# Altium project USB.PrjPcb
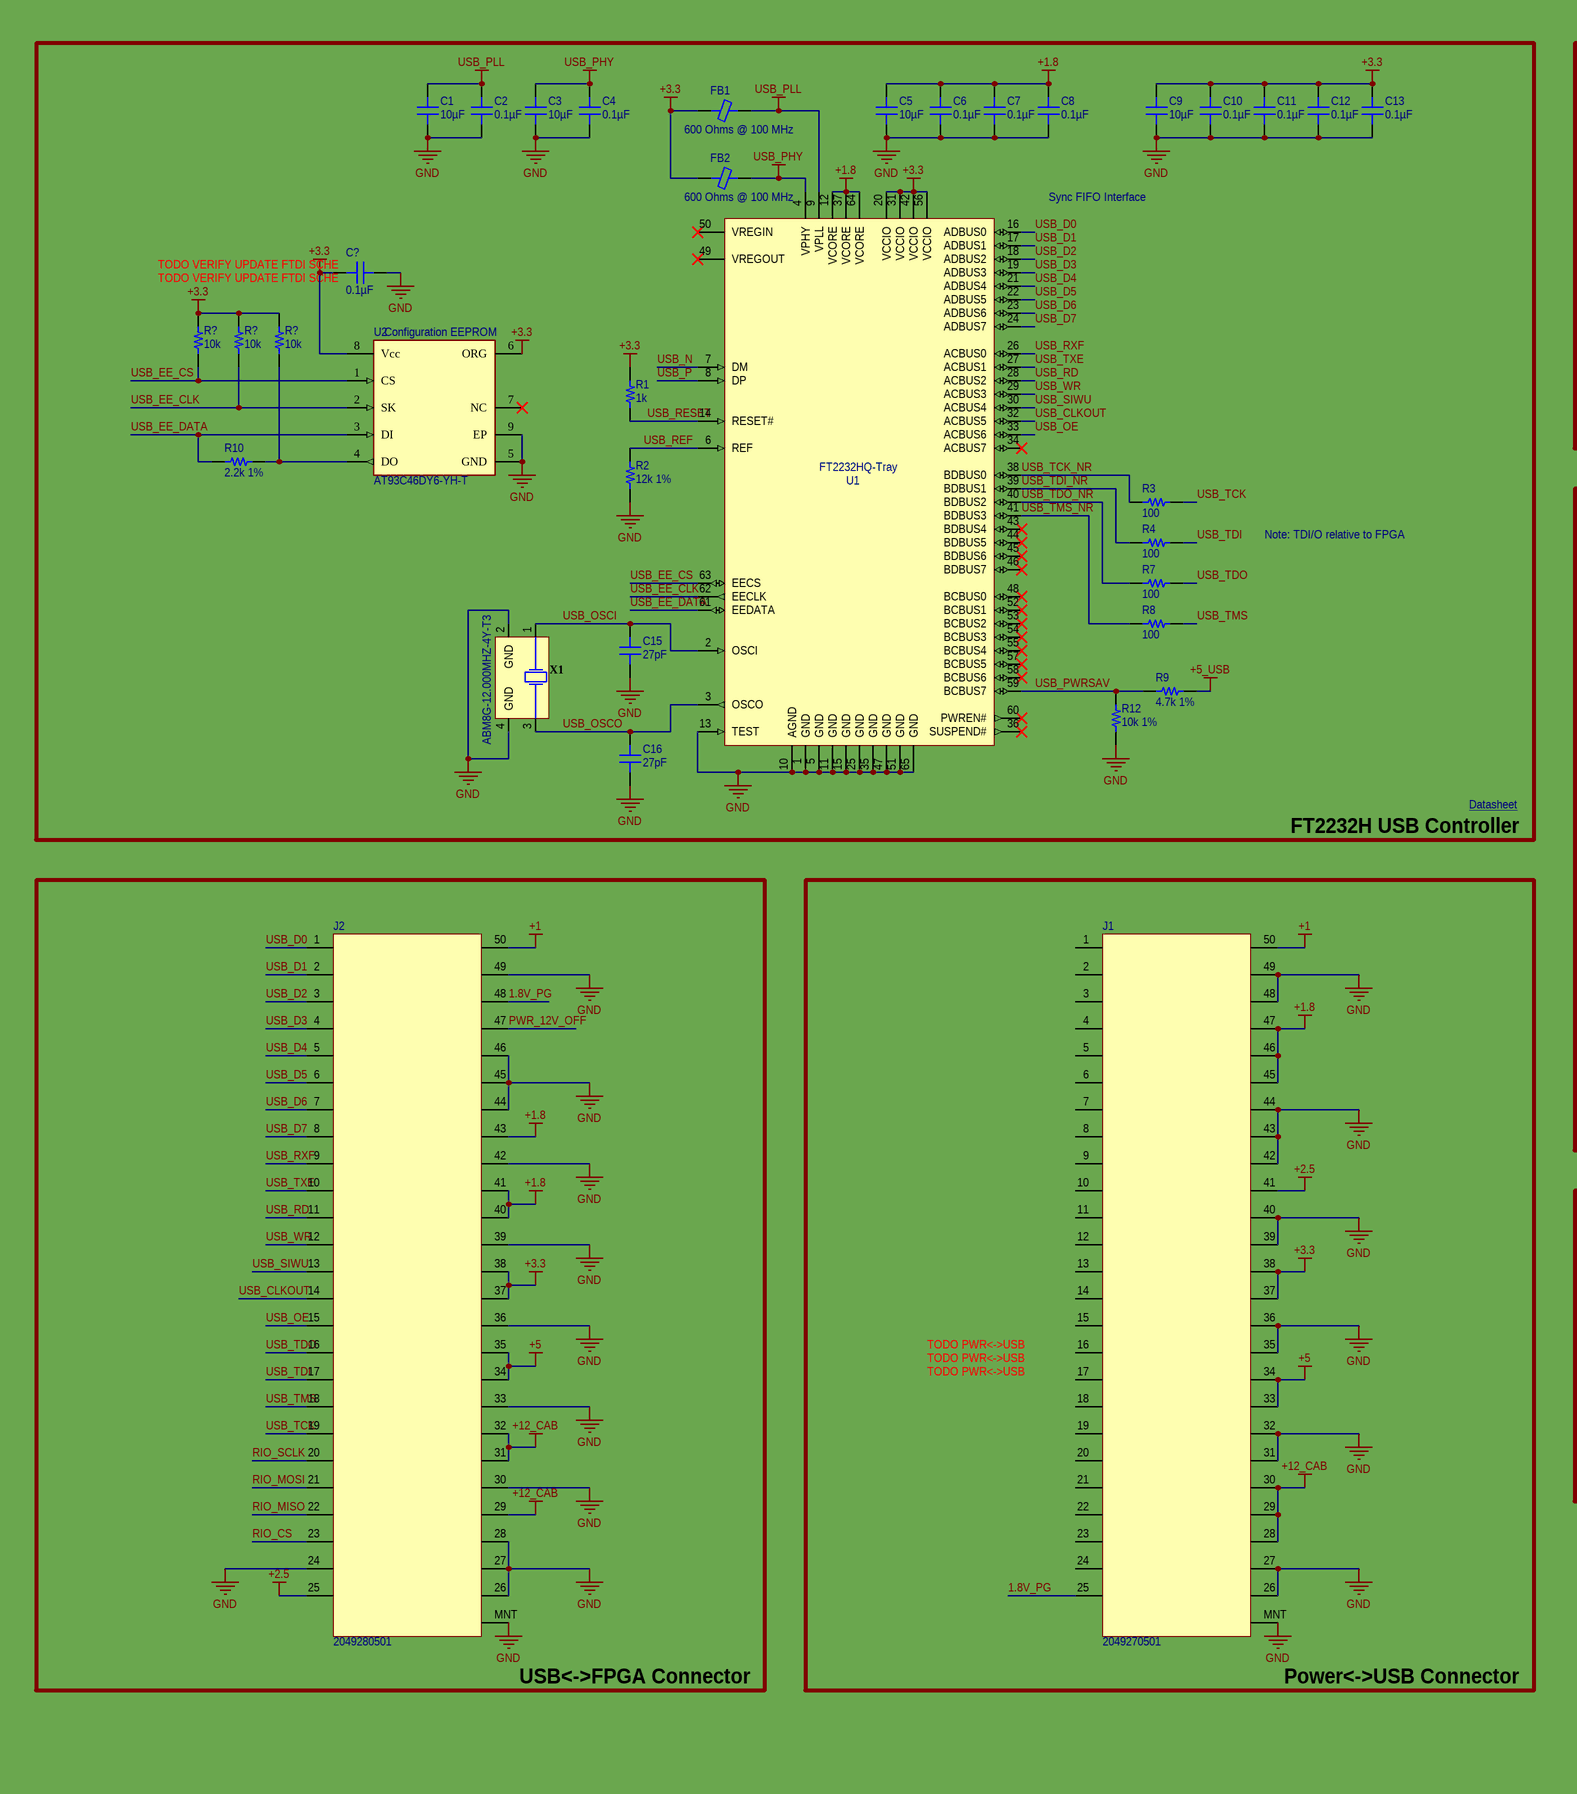
[diagram p0: USB.SchDoc, left]
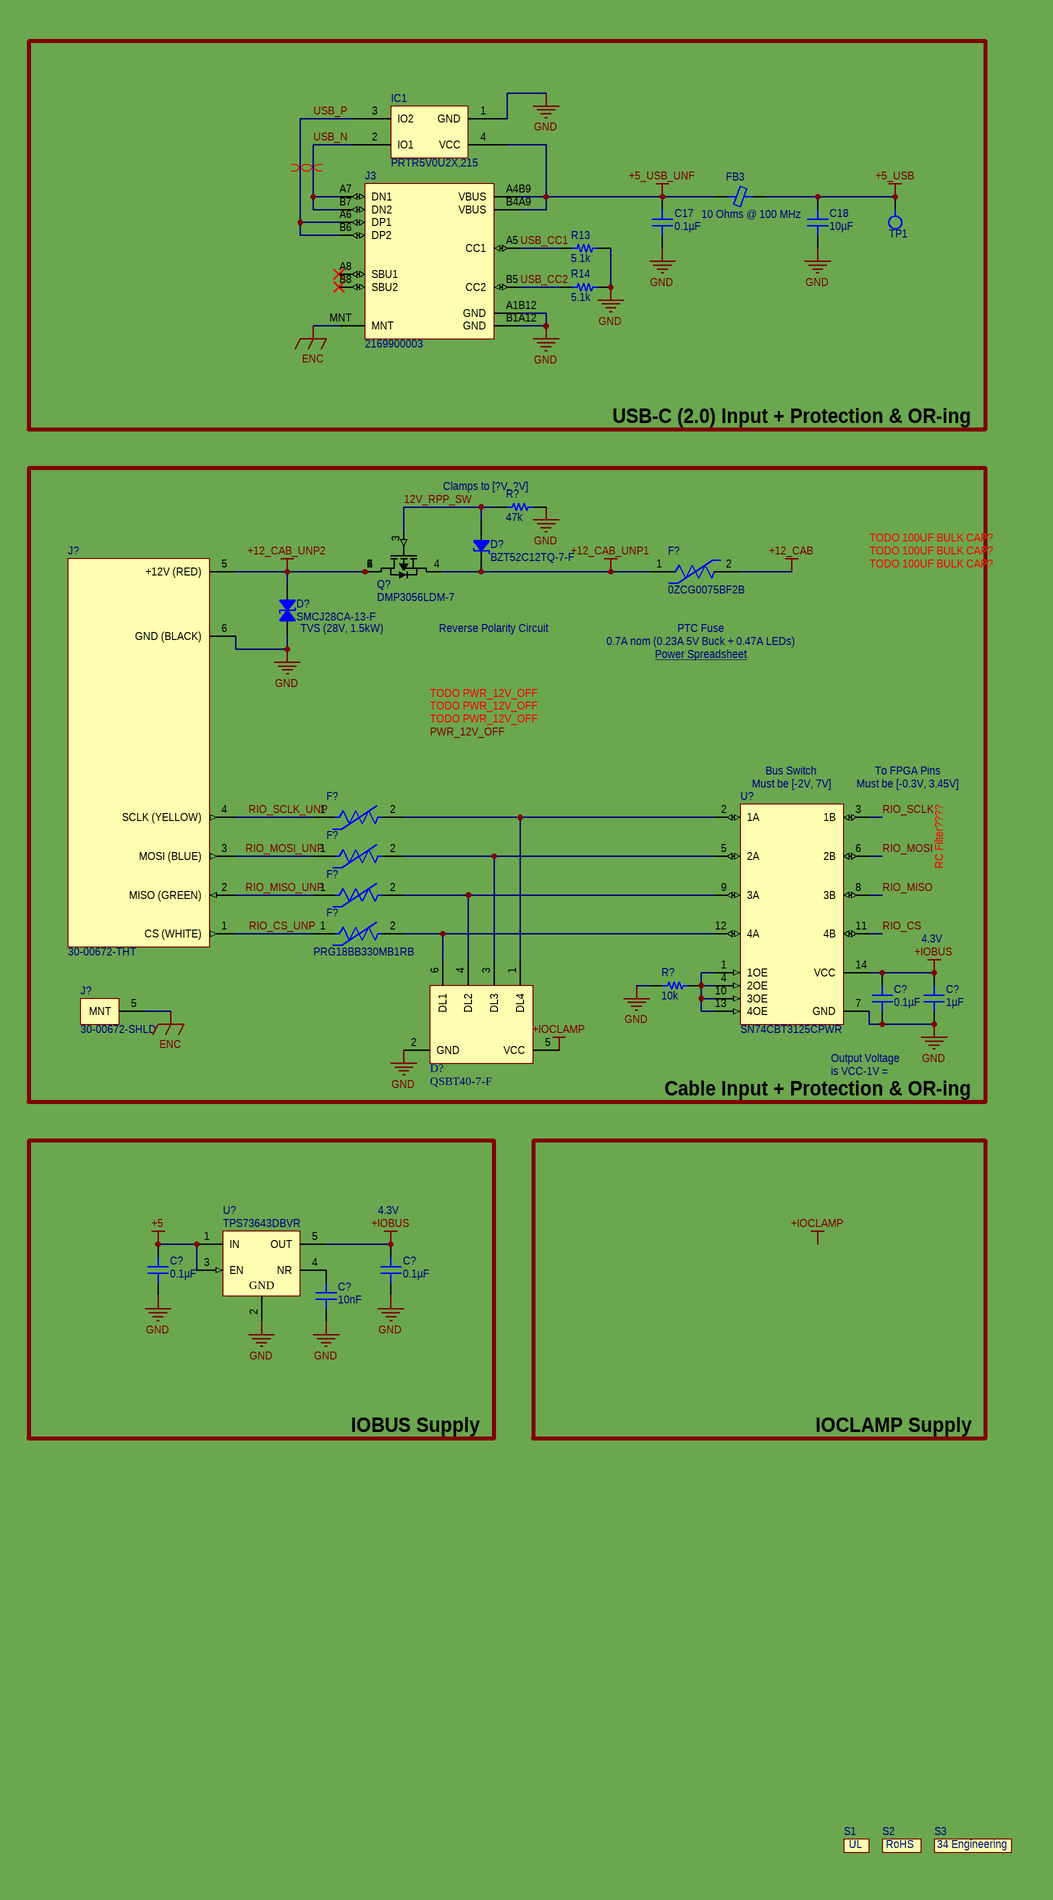
[diagram p1: USB.SchDoc, right]
1 sheet, 66 parts. Net scope: global (net labels, ports and power ports of the same name join across sheets).
Board file: USB.PcbDoc

## Sheet USB.SchDoc
size C; SheetNumber: 1; SheetTotal: 1

### Parts
(Parts that share a designator on the sheet are numbered #1, #2 ... from top to bottom, then left to right.)
C1  10µF  [CAP 0402_1005]
C2  0.1µF  [CAP 0402_1005]
C3  10µF  [CAP 0402_1005]
C4  0.1µF  [CAP 0402_1005]
C5  10µF  [CAP 0402_1005]
C6  0.1µF  [CAP 0402_1005]
C7  0.1µF  [CAP 0402_1005]
C8  0.1µF  [CAP 0402_1005]
C9  10µF  [CAP 0402_1005]
C10  0.1µF  [CAP 0402_1005]
C11  0.1µF  [CAP 0402_1005]
C12  0.1µF  [CAP 0402_1005]
C13  0.1µF  [CAP 0402_1005]
C15  27pF  [CAP 0402_1005]
C16  27pF  [CAP 0402_1005]
C17  0.1µF  [CAP 0402_1005]
C18  10µF  [CAP 0402_1005]
C?#1  0.1µF  [CAP 0402_1005]
C?#2  0.1µF  [CAP 0402_1005]
C?#3  1µF  [CAP 0402_1005]
C?#4  0.1µF  [CAP 0402_1005]
C?#5  0.1µF  [CAP 0402_1005]
C?#6  10nF  [CAP 0402_1005]
D?#1  BZT52C12TQ-7-F  [SOD523F]
D?#2  SMCJ28CA-13-F  [DO214AB SMC]
D?#3  QSBT40-7-F  [QSBT40-7-F]
F?#1  0ZCG0075BF2B  [FP-0ZCG0075BF2B-MFG]
F?#2  PRG18BB330MB1RB  [FP-PRF18-PRG18-0_15-MFG]
F?#3  PRG18BB330MB1RB  [FP-PRF18-PRG18-0_15-MFG]  (value not drawn)
F?#4  PRG18BB330MB1RB  [FP-PRF18-PRG18-0_15-MFG]  (value not drawn)
F?#5  PRG18BB330MB1RB  [FP-PRF18-PRG18-0_15-MFG]  (value not drawn)
FB1  600 Ohms @ 100 MHz  [FER 0603_1608]
FB2  600 Ohms @ 100 MHz  [FER 0603_1608]
FB3  10 Ohms @ 100 MHz  [FER 0402_1005]
IC1  PRTR5V0U2X,215  [SOT143B]
J1  2049270501  [2049270501]
J2  2049280501  [2049280501]
J3  2169900003  [2169900003]
J?#1  30-00672-THT  [30-00672-THT]
J?#2  30-00672-SHLD  [30-00672-SHLD]
Q?  DMP3056LDM-7  [SOT95P285X130-6N]
R1  1k  [RES 0402_1005]
R2  12k 1%  [RES 0402_1005]
R3  100  [RES 0402_1005]
R4  100  [RES 0402_1005]
R7  100  [RES 0402_1005]
R8  100  [RES 0402_1005]
R9  4.7k 1%  [RES 0402_1005]
R10  2.2k 1%  [RES 0402_1005]
R12  10k 1%  [RES 0402_1005]
R13  5.1k  [RES 0402_1005]
R14  5.1k  [RES 0402_1005]
R?#1  10k  [RES 0402_1005]
R?#2  10k  [RES 0402_1005]
R?#3  10k  [RES 0402_1005]
R?#4  47k  [RES 0603_1608]
R?#5  10k  [RES 0402_1005]
S1  (no value)  [UL]
S2  (no value)  [RoHS]
S3  (no value)  [34EngineeringLogo]
TP1  (no value)  [TestPoint1mm]
U1  FT2232HQ-Tray  [QFN64_2_N]
U2  AT93C46DY6-YH-T  [FP-C04-21355-Q4B-IPC_C]
U?#1  SN74CBT3125CPWR  [SN74CBT3125CPWR]
U?#2  TPS73643DBVR  [DBV0005A_N]
X1  ABM8G-12.000MHZ-4Y-T3  [ABM8G-12.000MHZ-4Y-T3]

### Blocks framed on the sheet
FT2232H USB Controller: C1-C13 C15 C16 C?#1 FB1 FB2 R1-R4 R7-R10 R12 R?#1-R?#3 U1 U2 X1
USB-C (2.0) Input + Protection & OR-ing: C17 C18 FB3 IC1 J3 R13 R14 TP1
Cable Input + Protection & OR-ing: C?#2 C?#3 D?#1-D?#3 F?#1-F?#5 J?#1 J?#2 Q? R?#4 R?#5 U?#1
USB<->FPGA Connector: J2
Power<->USB Connector: J1
IOBUS Supply: C?#4-C?#6 U?#2

### Nets
+1: J1.50 J2.50
+1.8: C5.2 C6.2 C7.2 C8.2 J1.45 J1.46 J1.47 J2.40 J2.41 J2.43 U1.12(VCORE) U1.37(VCORE) U1.64(VCORE)
+2.5: J1.41 J2.25
+3.3: C9.2 C10.2 C11.2 C12.2 C13.2 C?#1.2 FB1.1 FB2.1 J1.37 J1.38 J2.37 J2.38 R1.1 R?#1.2 R?#2.2 R?#3.2 U1.20(VCCIO) U1.31(VCCIO) U1.42(VCCIO) U1.56(VCCIO) U2.6(ORG) U2.8(Vcc)
+5: C?#4.1 J1.33 J1.34 J2.34 J2.35 U?#2.1(IN) U?#2.3(EN)
+5_USB: C18.2 FB3.2 R9.2 TP1.1
+5_USB_UNF: C17.2 FB3.1 IC1.4(VCC) J3.A4B9(VBUS) J3.B4A9(VBUS)
+12_CAB: F?#1.2 J1.28 J1.29 J1.30 J2.29 J2.31 J2.32
+12_CAB_UNP1: D?#1.2 F?#1.1 Q?.4
+12_CAB_UNP2: D?#2.2 J?#1.5(+12V_(RED)) Q?.1 Q?.2 Q?.5 Q?.6
+IOBUS: C?#2.1 C?#3.2 C?#5.1 U?#1.14(VCC) U?#2.5(OUT)
+IOCLAMP: D?#3.5(VCC)
ENC: J3.MNT J?#2.5(MNT)
GND: C1.1 C2.1 C3.1 C4.1 C5.1 C6.1 C7.1 C8.1 C9.1 C10.1 C11.1 C12.1 C13.1 C15.1 C16.1 C17.1 C18.1 C?#1.1 C?#2.2 C?#3.1 C?#4.2 C?#5.2 C?#6.1 D?#2.1 D?#3.2(GND) IC1.1(GND) J1.26 J1.27 J1.31 J1.32 J1.35 J1.36 J1.39 J1.40 J1.42 J1.43 J1.44 J1.48 J1.49 J1.MNT J2.24 J2.26 J2.27 J2.28 J2.30 J2.33 J2.36 J2.39 J2.42 J2.44 J2.45 J2.46 J2.49 J2.MNT J3.A1B12(GND) J3.B1A12(GND) J?#1.6(GND_(BLACK)) R2.1 R12.1 R13.2 R14.2 R?#4.2 R?#5.2 U1.1(GND) U1.5(GND) U1.10(AGND) U1.11(GND) U1.13(TEST) U1.15(GND) U1.25(GND) U1.35(GND) U1.47(GND) U1.51(GND) U1.65(GND) U2.5(GND) U2.9(EP) U?#1.7(GND) U?#2.2(GND) X1.2(GND) X1.4(GND)
USB_PHY: C3.2 C4.2 FB2.2 U1.4(VPHY)
USB_PLL: C1.2 C2.2 FB1.2 U1.9(VPLL)
1.8V_PG: J1.25 J2.48
12V_RPP_SW: D?#1.1 Q?.3 R?#4.1
PWR_12V_OFF: J2.47
RIO_CS: J2.23 U?#1.11(4B)
RIO_CS_UNP: F?#5.1 J?#1.1(CS_(WHITE))
RIO_MISO: J2.22 U?#1.8(3B)
RIO_MISO_UNP: F?#4.1 J?#1.2(MISO_(GREEN))
RIO_MOSI: J2.21 U?#1.6(2B)
RIO_MOSI_UNP: F?#3.1 J?#1.3(MOSI_(BLUE))
RIO_SCLK: J2.20 U?#1.3(1B)
RIO_SCLK_UNP: F?#2.1 J?#1.4(SCLK_(YELLOW))
USB_CC1: J3.A5(CC1) R13.1
USB_CC2: J3.B5(CC2) R14.1
USB_CLKOUT: J2.14 U1.32(ACBUS5)
USB_D0: J2.1 U1.16(ADBUS0)
USB_D1: J2.2 U1.17(ADBUS1)
USB_D2: J2.3 U1.18(ADBUS2)
USB_D3: J2.4 U1.19(ADBUS3)
USB_D4: J2.5 U1.21(ADBUS4)
USB_D5: J2.6 U1.22(ADBUS5)
USB_D6: J2.7 U1.23(ADBUS6)
USB_D7: J2.8 U1.24(ADBUS7)
USB_EE_CLK: R?#2.1 U1.62(EECLK) U2.2(SK)
USB_EE_CS: R?#1.1 U1.63(EECS) U2.1(CS)
USB_EE_DATA: R10.2 U1.61(EEDATA) U2.3(DI)
USB_N: IC1.2(IO1) J3.A7(DN1) J3.B7(DN2) U1.7(DM)
USB_OE: J2.15 U1.33(ACBUS6)
USB_OSCI: C15.2 U1.2(OSCI) X1.1
USB_OSCO: C16.2 U1.3(OSCO) X1.3
USB_P: IC1.3(IO2) J3.A6(DP1) J3.B6(DP2) U1.8(DP)
USB_PWRSAV: R9.1 R12.2 U1.59(BCBUS7)
USB_RD: J2.11 U1.28(ACBUS2)
USB_REF: R2.2 U1.6(REF)
USB_RESET: R1.2 U1.14(RESET#)
USB_RXF: J2.9 U1.26(ACBUS0)
USB_SIWU: J2.13 U1.30(ACBUS4)
USB_TCK: J2.19 R3.2
USB_TCK_NR: R3.1 U1.38(BDBUS0)
USB_TDI: J2.17 R4.2
USB_TDI_NR: R4.1 U1.39(BDBUS1)
USB_TDO: J2.16 R7.2
USB_TDO_NR: R7.1 U1.40(BDBUS2)
USB_TMS: J2.18 R8.2
USB_TMS_NR: R8.1 U1.41(BDBUS3)
USB_TXE: J2.10 U1.27(ACBUS1)
USB_WR: J2.12 U1.29(ACBUS3)
NetC?#6_2: C?#6.2 U?#2.4(NR)
NetD?#3_1: D?#3.1(DL4) F?#2.2 U?#1.2(1A)
NetD?#3_3: D?#3.3(DL3) F?#3.2 U?#1.5(2A)
NetD?#3_4: D?#3.4(DL2) F?#4.2 U?#1.9(3A)
NetD?#3_6: D?#3.6(DL1) F?#5.2 U?#1.12(4A)
NetR10_1: R10.1 R?#3.1 U2.4(DO)
NetR?#5_1: R?#5.1 U?#1.1(1OE) U?#1.4(2OE) U?#1.10(3OE) U?#1.13(4OE)

Not connected (* = marked no-connect by the designer): J1 1 2 3 4 5 6 7 8 9 10 11 12 13 14 15 16 17 18 19 20 21 22 23 24; J3 A8(SBU1)* B8(SBU2)*; U1 34(ACBUS7)* 36(SUSPEND#)* 43(BDBUS4)* 44(BDBUS5)* 45(BDBUS6)* 46(BDBUS7)* 48(BCBUS0)* 49(VREGOUT)* 50(VREGIN)* 52(BCBUS1)* 53(BCBUS2)* 54(BCBUS3)* 55(BCBUS4)* 57(BCBUS5)* 58(BCBUS6)* 60(PWREN#)*; U2 7(NC)*

### Layout directives
differential pair; differential pair class USB: USB_N, USB_P

### Notes on the sheet
- Sync FIFO Interface
- (near C?#1) TODO VERIFY UPDATE FTDI SCHE
- (near U2) Configuration EEPROM
- (near R?#4) Clamps to [?V, ?V]
- Note: TDI/O relative to FPGA
- TODO 100UF BULK CAP?
- (near D?#2) TVS (28V, 1.5kW)
- Reverse Polarity Circuit
- PTC Fuse
- TODO PWR_12V_OFF
- Power Spreadsheet <https://docs.google.com/spreadsheets/d/1ZgsUlgWdU-n38x_ZLdApPnWk-g0t3dJyEVXrgmfgov0/edit#gid=0>
- 0.7A nom (0.23A 5V Buck + 0.47A LEDs)
- Datasheet <https://www.ftdichip.com/Support/Documents/DataSheets/ICs/DS_FT2232H.pdf>
- (near U?#1) Must be [-2V, 7V]
- (near U?#1) Bus Switch
- (near U?#1) Must be [-0.3V, 3.45V]
- (near U?#1) To FPGA Pins
- RC Filter????
- (near C?#3) 4.3V
- Output Voltage is VCC-1V = 3.3V
- (near C?#5) 4.3V
- TODO PWR<->USB
- IOCLAMP Supply
- Labels drawn without touching a wire or pin: +IOCLAMP, PWR_12V_OFF
- (in symbol 34EngineeringLogo) 34 Engineering

### Library data of the parts
C1 C3 C5 C9 C18 = 0402ZD106MAT2A: CAP CER 10UF 10V X5R 0402; manufacturer: AVX Corporation; Tolerance: ±20%; Part Number: 0402ZD106MAT2A; Value: 10µF; Applications: General Purpose; Capacitance: 10µF; componentlink1description: Datasheet; componentlink1url: http://datasheets.avx.com/cx5r.pdf; componentlink2description: DigiKey Link; componentlink2url: http://digikey.com/product-detail/en/avx-corporation/0402ZD106MAT2A/478-10052-1-ND/6564275; Device Package: 0402 (1005 Metric); lastupdated: 2/8/2022 12:26:50 PM; Lifecycle Status: Active; Minimum Order: 1; Mounting Type: Surface Mount, MLCC; Operating Temperature: -55°C ~ 85°C; Package / Case: 0402 (1005 Metric); packaging: TapeAndReel; partid: 6854; Part Status: Active; price: 0.24; series: -; Size / Dimension: 0.039" L x 0.020" W (1.00mm x 0.50mm); Supplier 1: DigiKey; Supplier Part Number 1: 478-10052-1-ND; Temperature Coefficient: X5R; Thickness (Max): 0.028" (0.71mm); Voltage - Rated: 10V
C2 C4 C6-C8 C10-C13 C17 C?#1 C?#2 C?#4 C?#5 = 0402ZC104KAT2A: CAP CER 0.1UF 10V X7R 0402; manufacturer: AVX Corporation; Tolerance: ±10%; Part Number: 0402ZC104KAT2A; Value: 0.1µF; Applications: General Purpose; Capacitance: 0.1µF; componentlink1description: Datasheet; componentlink1url: http://datasheets.avx.com/X7RDielectric.pdf; componentlink2description: DigiKey Link; componentlink2url: http://digikey.com/product-detail/en/avx-corporation/0402ZC104KAT2A/478-7891-1-ND/3881514; Device Package: 0402 (1005 Metric); lastupdated: 2/8/2022 12:26:59 PM; Lifecycle Status: Active; Minimum Order: 1; Mounting Type: Surface Mount, MLCC; Operating Temperature: -55°C ~ 125°C; Package / Case: 0402 (1005 Metric); packaging: TapeAndReel; partid: 1757; Part Status: Active; price: 0.09; series: -; Size / Dimension: 0.039" L x 0.020" W (1.00mm x 0.50mm); Supplier 1: DigiKey; Supplier Part Number 1: 478-7891-1-ND; Temperature Coefficient: X7R; Thickness (Max): 0.022" (0.55mm); Voltage - Rated: 10V
C15 C16 = C0402C270J3GAC7867: CAP CER 27PF 25V NP0 0402; manufacturer: KEMET; Temperature Coefficient: C0G, NP0; Tolerance: ±5%; Part Number: C0402C270J3GAC7867; Value: 27 pF; Applications: General Purpose; Capacitance: 27 pF; componentlink1description: Datasheet; componentlink1url: https://api.kemet.com/component-edge/download/datasheet/C0402C270J3GACTU.pdf; componentlink2description: DigiKey Link; componentlink2url: https://www.digikey.com/en/products/detail/kemet/C0402C270J3GAC7867/2196521; Device Package: 0402 (1005 Metric); Features: Low ESL; lastupdated: 7/10/2022 8:59:41 AM; Lifecycle Status: Active; Minimum Order: 1; Mounting Type: Surface Mount, MLCC; Operating Temperature: -55°C ~ 125°C; Package / Case: 0402 (1005 Metric); packaging: TapeAndReel; partid: 1740; Part Status: Active; price: 0.06; series: SMD Comm C0G; Size / Dimension: 0.039" L x 0.020" W (1.00mm x 0.50mm); Supplier 1: DigiKey; Supplier Part Number 1: 399-14437-1-ND; Thickness (Max): 0.022" (0.55mm); Voltage - Rated: 25V
C?#3 = GRM155C71A105KE11D: CAP CER 1UF 10V X7S 0402; manufacturer: Murata Electronics; Tolerance: ±10%; Part Number: GRM155C71A105KE11D; Value: 1µF; Applications: General Purpose; Capacitance: 1 µF; componentlink1description: Datasheet; componentlink1url: https://search.murata.co.jp/Ceramy/image/img/A01X/G101/ENG/GRM155C71A105KE11-01.pdf; componentlink2description: DigiKey Link; componentlink2url: https://www.digikey.com/en/products/detail/murata-electronics/GRM155C71A105KE11D/6606086; Device Package: 0402 (1005 Metric); lastupdated: 8/25/2022 6:45:54 AM; Lifecycle Status: Active; Minimum Order: 1; Mounting Type: Surface Mount, MLCC; Operating Temperature: -55°C ~ 125°C; Package / Case: 0402 (1005 Metric); packaging: TapeAndReel; partid: 1749; Part Status: Active; price: 0.01; series: GRM; Size / Dimension: 0.039" L x 0.020" W (1.00mm x 0.50mm); Supplier 1: DigiKey; Supplier Part Number 1: 490-14457-1-ND; Temperature Coefficient: X7S; Thickness (Max): 0.024" (0.60mm); Voltage - Rated: 10V
C?#6 = CL05B103KA5VPNC: CAP CER 10000PF 25V X7R 0402; manufacturer: Samsung Electro-Mechanics; Tolerance: ±10%; Part Number: CL05B103KA5VPNC; Value: 10nF; Applications: Automotive; Capacitance: 10000 pF; componentlink1description: Datasheet; componentlink1url: http://www.samsungsem.com/kr/support/product-search/mlcc/CL05B103KA5VPNC.jsp; componentlink2description: DigiKey Link; componentlink2url: https://www.digikey.com/en/products/detail/samsung-electro-mechanics/CL05B103KA5VPNC/5961208; Device Package: 0402 (1005 Metric); lastupdated: 8/25/2022 6:45:53 AM; Lifecycle Status: Active; Minimum Order: 1; Mounting Type: Surface Mount, MLCC; Operating Temperature: -55°C ~ 125°C; Package / Case: 0402 (1005 Metric); packaging: TapeAndReel; partid: 1881; Part Status: Active; price: 0.01; Ratings: AEC-Q200; series: CL; Size / Dimension: 0.039" L x 0.020" W (1.00mm x 0.50mm); Supplier 1: DigiKey; Supplier Part Number 1: 1276-6724-1-ND; Temperature Coefficient: X7R; Thickness (Max): 0.022" (0.55mm); Voltage - Rated: 25V
D?#1 = BZT52C12TQ-7-F: DIODE ZENER 12V 300MW SOD523; Manufacturer: Diodes Incorporated; Current - Reverse Leakage @ Vr: 100 nA @ 8 V; Impedance (Max) (Zzt): 25 Ohms; Tolerance: ±5.4%; Voltage - Forward (Vf) (Max) @ If: 900 mV @ 10 mA; Part Number: BZT52C12TQ-7-F; ComponentLink1Description: Datasheet; ComponentLink1URL: https://www.diodes.com/assets/Datasheets/ds30502.pdf; ComponentLink2Description: DigiKey Link; ComponentLink2URL: https://www.digikey.com/en/products/detail/diodes-incorporated/BZT52C12TQ-7-F/8126111; LastUpdated: 8/14/2022 9:55:24 PM; Lifecycle Status: Active; Minimum Order: 1; Mounting Type: Surface Mount; Operating Temperature: -65°C ~ 150°C (TJ); Package / Case: SC-79, SOD-523; Packaging: TapeAndReel; PartId: 3438; Part Status: Active; Power - Max: 300 mW; Price: 0.03; Series: Automotive, AEC-Q101; Supplier 1: DigiKey; Supplier Part Number 1: BZT52C12TQ-7-FDICT-ND; Supplier Device Package: SOD-523; Voltage - Zener (Nom) (Vz): 12 V
D?#2 = SMCJ28CA-13-F: TVS DIODE 28VWM 45.4VC SMC; Manufacturer: Diodes Incorporated; Bidirectional Channels: 1; Current - Peak Pulse (10/1000µs): 33A; Power Line Protection: No; Power - Peak Pulse: 1500W (1.5kW); Type: Zener; Voltage - Breakdown (Min): 31.1V; Voltage - Clamping (Max) @ Ipp: 45.4V; Voltage - Reverse Standoff (Typ): 28V; Part Number: SMCJ28CA-13-F; Applications: General Purpose; ComponentLink1Description: Datasheet; ComponentLink1URL: https://www.diodes.com/assets/Datasheets/ds19003.pdf; ComponentLink2Description: DigiKey Link; ComponentLink2URL: https://www.digikey.com/en/products/detail/diodes-incorporated/SMCJ28CA-13-F/765437; LastUpdated: 8/14/2022 10:10:35 PM; Lifecycle Status: Active; Minimum Order: 1; Mounting Type: Surface Mount; Operating Temperature: -55°C ~ 150°C (TJ); Package / Case: DO-214AB, SMC; Packaging: TapeAndReel; PartId: 8285; Part Status: Active; Price: 0.35; Series: -; Supplier 1: DigiKey; Supplier Part Number 1: SMCJ28CA-FDICT-ND; Supplier Device Package: SMC
D?#3 = QSBT40-7-F: TVS DIODE 30VWM SOT363; Manufacturer: Diodes; Forward Current: 200mA; Max Reverse Current: 2uA; Forward Voltage: 1V; Max Power Dissipation: 2W; Operating Supply Voltage: 30V; Number of Bidirectional Channels: 4; Power Line Protection: No; Reverse Recovery Time: 5ns; Peak Non-Repetitive Surge Current: 600mA; Power Dissipation: 200mW; Supplier 1: RSComponents; Manufacturer Part Number: QSBT40-7-F; RoHS: Yes; Category: Schottky Diodes; Stock 1: 1; Pricing 1: 10=1.12300, 30=0.92500, 150=0.80600, 750=0.71200, 1500=0.56500 (USD); Mount: Surface Mount; Case/Package: SOT-363; Number of Pins: 6; Weight: 0.000212oz; Min Operating Temperature: -55°C; Max Operating Temperature: 125°C; Package Quantity: 3000; Packaging: Tape and Reel; Reverse Standoff Voltage: 30V; Max Repetitive Reverse Voltage (Vrrm): 30V; Max Forward Surge Current (Ifsm): 600mA; Termination: SMD/SMT; Power Rating: 200mW; Voltage Rating (DC): 30V; Current Rating: 200mA; Series: -; Length: 2.2mm; Width: 1.35mm; Height: 1mm; Radiation Hardening: No; REACH SVHC: No SVHC; Lead Free: Lead Free; RoHS Compliant: Yes; ComponentLink1URL: https://datasheet.ciiva.com/34302/1541351-34302412.pdf?src-supplier=Jameco; ComponentLink1Description: https://datasheet.ciiva.com/34302/1541351-34302412.pdf?src-supplier=Jameco; ComponentLink2URL: https://datasheet.ciiva.com/4715/ds30195-18356-4715689.pdf?src-supplier=Mouser; ComponentLink2Description: https://datasheet.ciiva.com/4715/ds30195-18356-4715689.pdf?src-supplier=Mouser; ComponentLink3URL: https://datasheet.ciiva.com/336/ds30195-336560.pdf?src-supplier=Digi-Key; ComponentLink3Description: https://datasheet.ciiva.com/336/ds30195-336560.pdf?src-supplier=Digi-Key; ComponentLink4URL: https://datasheet.ciiva.com/8301/ds30195-8301644.pdf?src-supplier=Avnet; ComponentLink4Description: https://datasheet.ciiva.com/8301/ds30195-8301644.pdf?src-supplier=Avnet; ComponentLink5URL: https://datasheet.ciiva.com/16393/ds30195-16393583.pdf?src-supplier=Future+Electronics; ComponentLink5Description: https://datasheet.ciiva.com/16393/ds30195-16393583.pdf?src-supplier=Future+Electronics; Supplier Part Number 1: 7514698
F?#1 = CMP-16043-000010-1: PTC RESET FUSE 33V 750MA 1812; Trip Current: 1.5A; Max Current Rating: 40A; Time to Trip: 0.2s; Case/Package: 1812; Case Code (Metric): 4532; Contact Plating: Tin; Case Code (Imperial): 1812; Lead Free: Lead Free; Max Operating Temperature: 85°C; Min Operating Temperature: -40°C; Hold Current: 750mA; Packaging: Tape and Reel; RoHS Compliant: Yes; Mount: Surface Mount; Package Quantity: 1
F?#2-F?#5 = CMP-06022-001109-1: PTC Thermistor for Temperature Sensor, 0603, 33Ω, 20%, 24V; Resistance: 33R; Current Rating: 900mA; Trip Current: 71mA; Hold Current: 36mA; Length: 1.6mm; REACH SVHC: No SVHC; Mount: Surface Mount; Case/Package: 0603; Width: 800um; Packaging: Tape and Reel; Depth: 0.8mm; Tolerance: 20%; RoHS Compliant: Yes; Max Supply Voltage: 24V; Package Quantity: 4000; Max Current Rating: 900mA; Voltage: 24V; Radiation Hardening: No; Series: POSISTOR® PRG18BB; Case Code (Metric): 1608; Lead Free: Lead Free; Min Operating Temperature: -10°C; Height: 0.8mm; Termination: SMD/SMT; Number of Pins: 2; Max Operating Temperature: 60°C; Case Code (Imperial): 0603
FB1 FB2 = BLM18AG601SN1D: FERRITE BEAD 600 OHM 0603 1LN; Manufacturer: Murata Electronics; Current Rating (Max): 500mA; DC Resistance (DCR) (Max): 380mOhm; Number of Lines: 1; Part Number: BLM18AG601SN1D; ComponentLink1Description: Datasheet; ComponentLink1URL: https://www.murata.com/en-us/products/productdata/8796738650142/ENFA0003.pdf; ComponentLink2Description: DigiKey Link; ComponentLink2URL: https://www.digikey.com/en/products/detail/murata-electronics/BLM18AG601SN1D/584225; Device Package: 0603 (1608 Metric); Height (Max): 0.037" (0.95mm); Impedance @ Frequency: 600 Ohms @ 100 MHz; LastUpdated: 7/10/2022 9:43:27 AM; Lifecycle Status: Active; Minimum Order: 1; Mounting Type: Surface Mount; Operating Temperature: -55°C ~ 125°C; Package / Case: 0603 (1608 Metric); Packaging: TapeAndReel; PartId: 848; Part Status: Active; Price: 0.02; Series: EMIFIL®, BLM18; Size / Dimension: 0.063" L x 0.032" W (1.60mm x 0.80mm); Supplier 1: DigiKey; Supplier Part Number 1: 490-1014-1-ND; Value: 600 Ohms @ 100 MHz
FB3 = BLM15AG100SN1D: FERRITE BEAD 10 OHM 0402 1LN; Manufacturer: Murata Electronics; Current Rating (Max): 1A; DC Resistance (DCR) (Max): 25mOhm; Number of Lines: 1; Part Number: BLM15AG100SN1D; ComponentLink1Description: Datasheet; ComponentLink1URL: https://www.murata.com/en-us/products/productdata/8796740059166/ENFA0018.pdf; ComponentLink2Description: DigiKey Link; ComponentLink2URL: https://www.digikey.com/en/products/detail/murata-electronics/BLM15AG100SN1D/1948283; Device Package: 0402 (1005 Metric); Height (Max): 0.022" (0.55mm); Impedance @ Frequency: 10 Ohms @ 100 MHz; LastUpdated: 7/10/2022 9:42:59 AM; Lifecycle Status: Active; Minimum Order: 1; Mounting Type: Surface Mount; Operating Temperature: -55°C ~ 125°C; Package / Case: 0402 (1005 Metric); Packaging: TapeAndReel; PartId: 230; Part Status: Active; Price: 0.01; Series: EMIFIL®, BLM15; Size / Dimension: 0.039" L x 0.022" W (1.00mm x 0.55mm); Supplier 1: DigiKey; Supplier Part Number 1: 490-5176-1-ND; Value: 10 Ohms @ 100 MHz
IC1 = PRTR5V0U2X,215: TVS DIODE 5.5V SOT143B; Manufacturer: Nexperia USA Inc.; Capacitance @ Frequency: 1pF @ 1MHz; Power Line Protection: Yes; Unidirectional Channels: 2; Voltage - Breakdown (Min): 6V; Voltage - Reverse Standoff (Typ): 5.5V (Max); Part Number: PRTR5V0U2X,215; Applications: General Purpose; ComponentLink1Description: Datasheet; ComponentLink1URL: https://assets.nexperia.com/documents/data-sheet/PRTR5V0U2X.pdf; ComponentLink2Description: DigiKey Link; ComponentLink2URL: //digikey.com/product-detail/en/nexperia-usa-inc/PRTR5V0U2X215/1727-3884-2-ND/1163690; Device Package: TO-253-4, TO-253AA; LastUpdated: 12/9/2019 9:29:05 PM; Lifecycle Status: 0; Minimum Order: 1; Mounting Type: Surface Mount; Operating Temperature: -40°C ~ 85°C (TA); Package / Case: TO-253-4, TO-253AA; Packaging: TapeAndReel; PartId: 5451; Part Status: Active; Price: 0.18; Series: -; Supplier 1: DigiKey; Supplier Part Number 1: 1727-3884-2-ND; Supplier Device Package: SOT-143B; Type: Steering (Rail to Rail)
J1 = 2049270501: SlimStack Board-to-Board Receptacle, 0.40mm Pitch, FSB3 Floating Series, 3.00mm Mated Height, 3.20mm Mated Width, 50...; Manufacturer: Molex; Manufacturer Part Number: 203955-0503; RoHS: No; Stock 1: 8587; Pricing 1: 1=3.72000, 10=3.28000, 50=3.28000, 100=2.61000, 1000=2.16000, 10000=2.01000 (USD); Supplier 1: Mouser; Supplier Part Number 1: 538-204927-0501
J2 = 2049280501: SlimStack Board-to-Board Plug, 0.40mm Pitch, FSB3 Floating Series, 3.00mm Mated Height, 3.20 Mated Width, 50 Circuits; Manufacturer: Molex; Manufacturer Part Number: 203955-0503; RoHS: No; Stock 1: 8554; Pricing 1: 1=4.46000, 10=3.93000, 50=3.93000, 100=3.13000, 500=3.04000, 1000=2.59000, 3000=2.41000, 6000=2.32000, 9000=2.23000, 10000=2.41000 (USD); Supplier 1: Mouser; Supplier Part Number 1: 538-204928-0501
J3 = 2169900003: USB-C (USB TYPE-C) USB 2.0 Receptacle Connector 24 (16+8 Dummy) Position Surface Mount, Right Angle; Through Hole; MF: Molex; Purchase-URL: https://pricing.snapeda.com/search/part/2169900003/?ref=eda; Price: None; SnapEDA_Link: https://www.snapeda.com/parts/2169900003/Molex/view-part/?ref=snap; Check_prices: https://www.snapeda.com/parts/2169900003/Molex/view-part/?ref=eda; Package: None; Availability: In Stock; Value: *; MP: 2169900003; Supplier 1: Digi-Key; Manufacturer: Molex; Manufacturer Part Number: 2169900003; RoHS: No; Stock 1: 5473; Pricing 1: 1=0.85000, 10=0.70500, 100=0.58720 (USD); Supplier Part Number 1: 900-2169900003CT-ND
J?#1 = 30-00672-THT: Multi-Conductor Cable Braid Thermoplastic Elastomer 6Conductors 28AWG 4.9mm 300V Black; Manufacturer: Tensility; Conductor Material: Copper; Number of Conductors: 6; Supplier 1: Digi-Key; Manufacturer Part Number: 30-00672; RoHS: No; Stock 1: 6; Pricing 1: 1=23.49000, 5=19.22200, 10=14.95100 (USD); Color: Black; Insulation Material: Polyurethane; Min Operating Temperature: -40°C; Max Operating Temperature: 80°C; Voltage: 300V; Wire/Cable Type: Multi-Conductor; Wire/Cable Gauge: 28AWG; ComponentLink1URL: http://www.tensility.com/pdffiles/30-00672.pdf?src-supplier=Digi-Key; ComponentLink1Description: http://www.tensility.com/pdffiles/30-00672.pdf?src-supplier=Digi-Key; Supplier Part Number 1: T1388-5-ND
J?#2 = 30-00672-SHLD: Multi-Conductor Cable Braid Thermoplastic Elastomer 6Conductors 28AWG 4.9mm 300V Black; Manufacturer: Tensility; Conductor Material: Copper; Number of Conductors: 6; Supplier 1: Digi-Key; Manufacturer Part Number: 30-00672; RoHS: No; Stock 1: 6; Pricing 1: 1=23.49000, 5=19.22200, 10=14.95100 (USD); Color: Black; Insulation Material: Polyurethane; Min Operating Temperature: -40°C; Max Operating Temperature: 80°C; Voltage: 300V; Wire/Cable Type: Multi-Conductor; Wire/Cable Gauge: 28AWG; ComponentLink1URL: http://www.tensility.com/pdffiles/30-00672.pdf?src-supplier=Digi-Key; ComponentLink1Description: http://www.tensility.com/pdffiles/30-00672.pdf?src-supplier=Digi-Key; Supplier Part Number 1: T1388-5-ND
Q? = DMP3056LDM-7: Trans Mosfet P-ch 30V 4.3A 6-PIN SOT-26 T/r / Mosfet P-ch 30V 4.3A SOT-26; Mfr_Name: Diodes Inc; Manufacturer_Part_Number: DMG4407SSS-13; Manufacturer: Diodes; Type: DEV; Rise Time: 6.6ns; Fall Time: 22.3ns; Turn-Off Delay Time: 50.1ns; Turn-On Delay Time: 10.2ns; Gate to Source Voltage (Vgs): 10V; Rds On Max: 45mR; Input Capacitance: 948pF; Number of Elements: 1; Max Power Dissipation: 1.5W; Drain to Source Breakdown Voltage: -30V; Element Configuration: Single; Polarity: P-CHANNEL; Copyright: Copyright (C) 2022 Ultra Librarian. All rights reserved.; RefDes: RefDes; Supplier 1: Arrow Electronics; Manufacturer Part Number: DMP3056LDM-7; RoHS: Yes; Category: MOSFETs; Stock 1: 366; Pricing 1: 1=0.31620, 10=0.31310, 25=0.30990, 100=0.23530, 250=0.23300, 500=0.20610, 1000=0.19360, 3000=0.17330 (USD); Mount: Surface Mount; Case/Package: SOT-26-6; Number of Pins: 6; Weight: 0.000529oz; Min Operating Temperature: -55°C; Max Operating Temperature: 150°C; Continuous Drain Current (ID): 4.3A; Package Quantity: 3000; Packaging: Cut Tape; Drain to Source Voltage (Vdss): 30V; Power Dissipation: 1.5W; Drain to Source Resistance: 45mR; Number of Channels: 1; Series: DMP3056; Length: 3mm; Width: 1.6mm; Height: 1.1mm; Radiation Hardening: No; REACH SVHC: No SVHC; Lead Free: Lead Free; RoHS Compliant: Yes; ComponentLink1URL: https://datasheet.ciiva.com/935/ds31449-935056.pdf?src-supplier=Digi-Key; ComponentLink1Description: https://datasheet.ciiva.com/935/ds31449-935056.pdf?src-supplier=Digi-Key; ComponentLink2URL: https://datasheet.ciiva.com/935/ds31449-935055.pdf?src-supplier=Digi-Key; ComponentLink2Description: https://datasheet.ciiva.com/935/ds31449-935055.pdf?src-supplier=Digi-Key; ComponentLink3URL: https://datasheet.ciiva.com/935/ds31449-935057.pdf?src-supplier=Digi-Key; ComponentLink3Description: https://datasheet.ciiva.com/935/ds31449-935057.pdf?src-supplier=Digi-Key; ComponentLink4URL: https://datasheet.ciiva.com/11176/ds31449-11176470.pdf?src-supplier=Avnet; ComponentLink4Description: https://datasheet.ciiva.com/11176/ds31449-11176470.pdf?src-supplier=Avnet; ComponentLink5URL: https://datasheet.ciiva.com/8115/ds31449-8115483.pdf?src-supplier=Avnet; ComponentLink5Description: https://datasheet.ciiva.com/8115/ds31449-8115483.pdf?src-supplier=Avnet; Supplier Part Number 1: DMP3056LDM-7
R1 = RQ73C1E1K0BTD: RES 1 KOHMS 0.1% 1/16W 0402; Manufacturer: TE Connectivity Passive Product; Value: 1 kOhms; Power (Watts): 0.063W, 1/16W; Temperature Coefficient: ±10ppm/°C; Part Number: RQ73C1E1K0BTD; ComponentLink1Description: Datasheet; ComponentLink1URL: //media.digikey.com/pdf/Data%20Sheets/Tyco%20Electronics%20P%20B%20PDFs/RQ73-0618%20v2.pdf; ComponentLink2Description: DigiKey Link; ComponentLink2URL: https://www.digikey.com/en/products/detail/te-connectivity-passive-product/RQ73C1E1K0BTD/9479889; Composition: Thin Film; Device Package: 0402 (1005 Metric); Features: Anti-Sulfur, Automotive AEC-Q200; Height - Seated (Max): 0.016" (0.40mm); LastUpdated: 7/10/2022 9:15:05 AM; Lifecycle Status: Active; Minimum Order: 1; Number of Terminations: 2; Operating Temperature: -55°C ~ 155°C; Package / Case: 0402 (1005 Metric); Packaging: TapeAndReel; PartId: 3061; Part Status: Active; Price: 0.28; Ratings: AEC-Q200; Resistance: 1 kOhms; Series: RQ73; Size / Dimension: 0.039" L x 0.020" W (1.00mm x 0.50mm); Supplier 1: DigiKey; Supplier Part Number 1: A139941CT-ND; Supplier Device Package: 0402; Tolerance: ±0.1%
R2 = RMCF0402FT12K0: RES 12K OHM 1% 1/16W 0402; Manufacturer: Stackpole Electronics Inc; Value: 12 kOhms; Power (Watts): 0.063W, 1/16W; Temperature Coefficient: ±100ppm/°C; Part Number: RMCF0402FT12K0; ComponentLink1Description: Datasheet; ComponentLink1URL: https://www.seielect.com/catalog/sei-rmcf_rmcp.pdf; ComponentLink2Description: DigiKey Link; ComponentLink2URL: https://www.digikey.com/en/products/detail/stackpole-electronics-inc/RMCF0402FT12K0/1714419; Composition: Thick Film; Device Package: 0402 (1005 Metric); Features: Automotive AEC-Q200; Height - Seated (Max): 0.016" (0.40mm); LastUpdated: 7/10/2022 9:15:01 AM; Lifecycle Status: Active; Minimum Order: 1; Number of Terminations: 2; Operating Temperature: -55°C ~ 155°C; Package / Case: 0402 (1005 Metric); Packaging: CutTape; PartId: 4499; Part Status: Active; Price: 0.01; Ratings: AEC-Q200; Resistance: 12 kOhms; Series: RMCF; Size / Dimension: 0.039" L x 0.020" W (1.00mm x 0.50mm); Supplier 1: DigiKey; Supplier Part Number 1: RMCF0402FT12K0CT-ND; Supplier Device Package: 0402; Tolerance: ±1%
R3 R4 R7 R8 = RCA0402100RFKED: RES SMD 100 OHM 1% 1/16W 0402; Manufacturer: Vishay Dale; Value: 100 Ohms; Power (Watts): 0.063W, 1/16W; Temperature Coefficient: ±100ppm/°C; Part Number: RCA0402100RFKED; ComponentLink1Description: Datasheet; ComponentLink1URL: http://www.vishay.com/docs/20037/rcae3.pdf; ComponentLink2Description: DigiKey Link; ComponentLink2URL: http://digikey.com/product-detail/en/vishay-dale/RCA0402100RFKED/541-2177-1-ND/4946830; Composition: Thick Film; Device Package: 0402 (1005 Metric); Features: Anti-Sulfur, Automotive AEC-Q200; Height - Seated (Max): 0.016" (0.40mm); LastUpdated: 7/10/2022 9:15:04 AM; Lifecycle Status: Active; Minimum Order: 1; Number of Terminations: 2; Operating Temperature: -55°C ~ 155°C; Package / Case: 0402 (1005 Metric); Packaging: TapeAndReel; PartId: 3179; Part Status: Active; Price: 0.01; Ratings: AEC-Q200; Resistance: 100 Ohms; Series: RCA; Size / Dimension: 0.039" L x 0.020" W (1.00mm x 0.50mm); Supplier 1: DigiKey; Supplier Part Number 1: 541-2177-1-ND; Supplier Device Package: 0402; Tolerance: ±1%
R9 = RT0402FRE074K7L: RES SMD 4.7K OHM 1% 1/16W 0402; Manufacturer: Yageo; Value: 4.7 kOhms; Power (Watts): 0.063W, 1/16W; Temperature Coefficient: ±50ppm/°C; Part Number: RT0402FRE074K7L; ComponentLink1Description: Datasheet; ComponentLink1URL: https://www.yageo.com/upload/media/product/productsearch/datasheet/rchip/PYu-RT_1-to-0.01_RoHS_L_11.pdf; ComponentLink2Description: DigiKey Link; ComponentLink2URL: https://www.digikey.com/en/products/detail/yageo/RT0402FRE074K7L/1072052; Composition: Thin Film; Device Package: 0402 (1005 Metric); Height - Seated (Max): 0.014" (0.35mm); LastUpdated: 7/10/2022 9:15:04 AM; Lifecycle Status: Active; Minimum Order: 1; Number of Terminations: 2; Operating Temperature: -55°C ~ 155°C; Package / Case: 0402 (1005 Metric); Packaging: TapeAndReel; PartId: 3198; Part Status: Active; Price: 0.01; Resistance: 4.7 kOhms; Series: RT; Size / Dimension: 0.039" L x 0.020" W (1.00mm x 0.50mm); Supplier 1: DigiKey; Supplier Part Number 1: YAG3347CT-ND; Supplier Device Package: 0402; Tolerance: ±1%
R10 = SR0402FR-7T2K2L: RES 2.2K OHM 1% 1/5W 0402; Manufacturer: Yageo; Value: 2.2 kOhms; Power (Watts): 0.2W, 1/5W; Temperature Coefficient: ±100ppm/°C; Part Number: SR0402FR-7T2K2L; ComponentLink1Description: Datasheet; ComponentLink1URL: http://www.yageo.com/documents/recent/PYu-SR_D_F%20tol_RoHS_L_4.pdf; ComponentLink2Description: DigiKey Link; ComponentLink2URL: https://www.digikey.com/en/products/detail/yageo/SR0402FR-7T2K2L/9373092; Composition: Thick Film; Device Package: 0402 (1005 Metric); Features: Automotive AEC-Q200, Pulse Withstanding; Height - Seated (Max): 0.016" (0.40mm); LastUpdated: 7/10/2022 9:15:01 AM; Lifecycle Status: Active; Minimum Order: 1; Number of Terminations: 2; Operating Temperature: -55°C ~ 155°C; Package / Case: 0402 (1005 Metric); Packaging: TapeAndReel; PartId: 4414; Part Status: Active; Price: 0.11; Ratings: AEC-Q200; Resistance: 2.2 kOhms; Series: SR; Size / Dimension: 0.039" L x 0.020" W (1.00mm x 0.50mm); Supplier 1: DigiKey; Supplier Part Number 1: YAG5818CT-ND; Supplier Device Package: 0402; Tolerance: ±1%
R12 = RCG040210K0FKED: RES SMD 10K OHM 1% 1/16W 0402; Manufacturer: Vishay Dale; Value: 10 kOhms; Power (Watts): 0.063W, 1/16W; Temperature Coefficient: ±100ppm/°C; Part Number: RCG040210K0FKED; ComponentLink1Description: Datasheet; ComponentLink1URL: http://www.vishay.com/docs/20047/rcge3.pdf; ComponentLink2Description: DigiKey Link; ComponentLink2URL: https://www.digikey.com/en/products/detail/vishay-dale/RCG040210K0FKED/4172356; Composition: Thick Film; Device Package: 0402 (1005 Metric); Height - Seated (Max): 0.016" (0.40mm); LastUpdated: 7/10/2022 9:14:58 AM; Lifecycle Status: Active; Minimum Order: 1; Number of Terminations: 2; Operating Temperature: -55°C ~ 155°C; Package / Case: 0402 (1005 Metric); Packaging: TapeAndReel; PartId: 5044; Part Status: Active; Price: 0.01; Resistance: 10 kOhms; Series: RCG e3; Size / Dimension: 0.039" L x 0.020" W (1.00mm x 0.50mm); Supplier 1: DigiKey; Supplier Part Number 1: 541-1747-1-ND; Supplier Device Package: 0402; Tolerance: ±1%
R13 R14 = ERJ-PA2F5101X: RES SMD 5.1 KOHM 1% 1/5W 0402; Manufacturer: Panasonic Electronic Components; Value: 5.1 kOhms; Power (Watts): 0.2W, 1/5W; Temperature Coefficient: ±100ppm/°C; Part Number: ERJ-PA2F5101X; ComponentLink1Description: Datasheet; ComponentLink1URL: https://industrial.panasonic.com/cdbs/www-data/pdf/RDO0000/AOA0000C331.pdf; ComponentLink2Description: DigiKey Link; ComponentLink2URL: https://www.digikey.com/en/products/detail/panasonic-electronic-components/ERJ-PA2F5101X/9815254; Composition: Thick Film; Device Package: 0402 (1005 Metric); Features: Automotive AEC-Q200, Pulse Withstanding; Height - Seated (Max): 0.016" (0.40mm); LastUpdated: 7/10/2022 9:14:48 AM; Lifecycle Status: Active; Minimum Order: 1; Number of Terminations: 2; Operating Temperature: -55°C ~ 155°C; Package / Case: 0402 (1005 Metric); Packaging: TapeAndReel; PartId: 8439; Part Status: Active; Price: 0.02; Ratings: AEC-Q200; Resistance: 5.1 kOhms; Series: ERJ-PA2; Size / Dimension: 0.039" L x 0.020" W (1.00mm x 0.50mm); Supplier 1: DigiKey; Supplier Part Number 1: P124488CT-ND; Supplier Device Package: 402; Tolerance: ±1%
R?#1-R?#3 R?#5 = MCS0402MC1002FE000: RES SMD 10K OHM 1% 1/10W 0402; Manufacturer: Vishay Beyschlag; Value: 10 kOhms; Power (Watts): 0.1W, 1/10W; Temperature Coefficient: ±50ppm/°C; Part Number: MCS0402MC1002FE000; ComponentLink1Description: Datasheet; ComponentLink1URL: http://www.vishay.com/docs/28760/mcat_pro.pdf; ComponentLink2Description: DigiKey Link; ComponentLink2URL: http://digikey.com/product-detail/en/vishay-beyschlag/MCS0402MC1002FE000/MCS0402-10.0K-MFCT-ND/3883092; Composition: Thin Film; Device Package: 0402 (1005 Metric); Features: Anti-Sulfur, Automotive AEC-Q200; Height - Seated (Max): 0.015" (0.37mm); LastUpdated: 7/10/2022 9:15:04 AM; Lifecycle Status: Active; Minimum Order: 1; Number of Terminations: 2; Operating Temperature: -55°C ~ 175°C; Package / Case: 0402 (1005 Metric); Packaging: TapeAndReel; PartId: 3152; Part Status: Active; Price: 0.03; Ratings: AEC-Q200; Resistance: 10 kOhms; Series: MCS AT - Professional; Size / Dimension: 0.039" L x 0.020" W (1.00mm x 0.50mm); Supplier 1: DigiKey; Supplier Part Number 1: MCS0402-10.0K-MFCT-ND; Supplier Device Package: 0402; Tolerance: ±1%
R?#4 = CRCW060347K0FKEAHP: RES SMD 47K OHM 1% 1/3W 0603; Manufacturer: Vishay Dale; Value: 47 kOhms; Power (Watts): 0.333W, 1/3W; Temperature Coefficient: ±100ppm/°C; Part Number: CRCW060347K0FKEAHP; ComponentLink1Description: Datasheet; ComponentLink1URL: http://www.vishay.com/docs/20043/crcwhpe3.pdf; ComponentLink2Description: DigiKey Link; ComponentLink2URL: https://www.digikey.com/en/products/detail/vishay-dale/CRCW060347K0FKEAHP/2222271; Composition: Thick Film; Device Package: 0603 (1608 Metric); Features: Automotive AEC-Q200, Pulse Withstanding; Height - Seated (Max): 0.022" (0.55mm); LastUpdated: 7/10/2022 9:22:30 AM; Lifecycle Status: Active; Minimum Order: 1; Number of Terminations: 2; Operating Temperature: -55°C ~ 155°C; Package / Case: 0603 (1608 Metric); Packaging: TapeAndReel; PartId: 7094; Part Status: Active; Price: 0.02; Ratings: AEC-Q200; Resistance: 47 kOhms; Series: CRCW-HP; Size / Dimension: 0.063" L x 0.033" W (1.60mm x 0.85mm); Supplier 1: DigiKey; Supplier Part Number 1: 541-47.0KSCT-ND; Supplier Device Package: 0603; Tolerance: ±1%
S1 = UL
S2 = RoHS
S3 = 34EngineeringLogo: 34 Engineering Silkscreen Logo
TP1 = TestPoint1mm: Test Point 1mm Diameter
U1 = CMP-0078-00003-3: Dual High Speed USB To Multipurpose UART/FIFO IC, 64-pin QFN, Tray; Manufacturer: FTDI; PackageVersion: Jun-12; ComponentLink2URL: http://www.ftdichip.com/Support/Documents/DataSheets/ICs/DS_FT2232H.pdf; ComponentLink1Description: Manufacturer URL; RevisionNote: DatasheetVersion updated to 2.21 Jun-2012; PackageReference: QFN64_2; PackageDescription: 64-Pin Quad Flat No-Lead, 9 x 9 mm Body, 0.5 mm Pitch, 4.35 x 4.35 mm Exposed Pad; ComponentLink2Description: Datasheet; ComponentLink1URL: http://www.ftdichip.com/; PartNumber: FT2232HQ-Tray; DatasheetVersion: ver 2.21, Jun-2012
U2 = CMP-06313-000080-1: IC EEPROM 1KBIT SPI 8MINI MAP; Frequency: 2MHz; Memory Type: Non-Volatile; Memory Size: 1Kb; Max Operating Temperature: 85°C; RoHS Compliant: Yes; Packaging: Tape and Reel; Min Operating Temperature: -40°C; Mount: Surface Mount
U?#1 = SN74CBT3125CPWR: 5-V, 1: 1 (SPST), 4-channel FET bus switch with –2-V undershoot protection 14-TSSOP -40 to 85; Manufacturer: Texas Instruments; Nominal Supply Current: 3uA; Propagation Delay: 0.15ns; Min Supply Voltage: 4V; Operating Supply Voltage: 5V; Max Supply Voltage: 5.5V; Number of Elements: 4; On-State Resistance: 12R; High Level Output Current: -128mA; Low Level Output Current: 128mA; Turn-On Delay Time: 4.4ns; Supply Type: Single; Bandwidth: 200MHz; Output Current: 64mA; Supplier 1: Digi-Key; Manufacturer Part Number: SN74CBT3125CPWR; RoHS: Yes; Category: Decoders and Multiplexers; Stock 1: 615; Pricing 1: 1=0.71000, 10=0.62300, 25=0.58480, 100=0.47740, 250=0.44340, 500=0.37736, 1000=0.30189 (USD); Mount: Surface Mount; Case/Package: TSSOP; Number of Pins: 14; Weight: 0.002018oz; Contact Plating: Gold; Min Operating Temperature: -40°C; Max Operating Temperature: 85°C; Package Quantity: 1; Packaging: Tape and Reel; Number of Bits: 4; Quiescent Current: 3uA; Independent Circuits: 4; Number of Channels: 4; Number of Switches: 4; Series: 74CBT; Supply Current: 3uA; Technology: CMOS; Throw Configuration: SPST; Radiation Hardening: No; Lead Free: Lead Free; RoHS Compliant: Yes; ComponentLink1URL: https://datasheet.ciiva.com/15097/getdatasheetpartid-526189-15097058.pdf?src-supplier=Verical; ComponentLink1Description: https://datasheet.ciiva.com/15097/getdatasheetpartid-526189-15097058.pdf?src-supplier=Verical; ComponentLink2URL: https://datasheet.ciiva.com/1891/sn74cbt3125c-1891000.pdf?src-supplier=Digi-Key; ComponentLink2Description: https://datasheet.ciiva.com/1891/sn74cbt3125c-1891000.pdf?src-supplier=Digi-Key; ComponentLink3URL: https://datasheet.ciiva.com/1890/sn74cbt3125c-1890999.pdf?src-supplier=Digi-Key; ComponentLink3Description: https://datasheet.ciiva.com/1890/sn74cbt3125c-1890999.pdf?src-supplier=Digi-Key; ComponentLink4URL: https://datasheet.ciiva.com/1891/sn74cbt3125c-1891001.pdf?src-supplier=Digi-Key; ComponentLink4Description: https://datasheet.ciiva.com/1891/sn74cbt3125c-1891001.pdf?src-supplier=Digi-Key; ComponentLink5URL: https://datasheet.ciiva.com/3170/sn74cbt3125c-3170634.pdf?src-supplier=Avnet; ComponentLink5Description: https://datasheet.ciiva.com/3170/sn74cbt3125c-3170634.pdf?src-supplier=Avnet; Supplier Part Number 1: 296-SN74CBT3125CPWRCT-ND
U?#2 = CMP-0395-00255-2: Single Output Low Noise LDO, 400 mA, Fixed 4.3 V Output, 1.7 to 5.5 V Input, with Reverse Current Protection, 5-pin SOT-23 (DBV), -40 to 85 degC, Green (RoHS & no Sb/Br); Manufacturer: Texas Instruments; Vout Adj(Min)(V): 4.3; Vin(Max)(V): 5.5; Vdo(Typ)(mV): 75; Vin(Min)(V): 1.7; Iq(Typ)(mA): 0.3; Iout(Max)(A): 0.4; Rating: Catalog; Accuracy(%): 1; SubFamily: Single Channel LDO; PackageDescription: 5-Pin Plastic Small Outline, Body 1.60 Ãƒâ€” 2.90 mm, Pitch 0.95 mm; Code_JEDEC: MO-178; PackageReference: DBV0005A; DatasheetVersion: SBVS038T; ComponentLink2Description: Datasheet; ComponentLink1Description: Manufacturer URL; Eco-Plan: Green (RoHS & no Sb/Br); ComponentLink3Description: Package Specification; ComponentLink4URL: Samples URL:http://www.ti.com/product/tps73643#samples; ComponentLink3URL: http://www.ti.com/litv/pdf/mpds018i; PartNumber: TPS73643DBVR; Vout Adj(Max)(V): 4.3; ComponentLink1URL: http://www.ti.com/; Mounting Technology: Surface Mount; PackageVersion: 4073253-4/K; ComponentLink4Description: URL Link1; ComponentLink2URL: http://www.ti.com/general/docs/lit/getliterature.tsp?genericPartNumber=TPS73643&fileType=pdf; Fixed Output Options(V): 4.3
X1 = ABM8G-12.000MHZ-4Y-T3: ABRACON - ABM8G-12.000MHZ-4Y-T3 - CRYSTAL, 12MHZ, 10PF, 3.2 X 2.5MM; ESR (Equivalent Series Resistance): 120R; Frequency Tolerance: 30ppm; Supplier 1: Digi-Key; RoHS: Yes; Stock 1: 11481; Pricing 1: 1=0.67000, 10=0.59600, 50=0.55720, 100=0.49250, 500=0.46656, 1000=0.38880 (USD); Mount: Surface Mount; Case/Package: CSMD; Number of Pins: 4; Min Operating Temperature: -10°C; Max Operating Temperature: 60°C; Frequency: 12MHz; Load Capacitance: 10pF; Packaging: Tape and Reel; Frequency Stability: 30ppm; Series: ABM8G; Series Resistance: 120R; Operating Frequency: 12 MHz; Length: 3.2mm; Width: 0.098inch; Height: 0.039inch; Depth: 2.5mm; REACH SVHC: No SVHC; Lead Free: Lead Free; ComponentLink1URL: https://datasheet.ciiva.com/15116/getdatasheetpartid-719872-15116768.pdf?src-supplier=Verical; ComponentLink1Description: https://datasheet.ciiva.com/15116/getdatasheetpartid-719872-15116768.pdf?src-supplier=Verical; ComponentLink2URL: https://datasheet.ciiva.com/857/abm8g-857959.pdf?src-supplier=Digi-Key; ComponentLink2Description: https://datasheet.ciiva.com/857/abm8g-857959.pdf?src-supplier=Digi-Key; ComponentLink3URL: https://datasheet.ciiva.com/857/abm8g-857960.pdf?src-supplier=Digi-Key; ComponentLink3Description: https://datasheet.ciiva.com/857/abm8g-857960.pdf?src-supplier=Digi-Key; ComponentLink4URL: https://datasheet.ciiva.com/857/abm8g-857961.pdf?src-supplier=Digi-Key; ComponentLink4Description: https://datasheet.ciiva.com/857/abm8g-857961.pdf?src-supplier=Digi-Key; ComponentLink5URL: https://datasheet.ciiva.com/16216/abm8g-16216655.pdf?src-supplier=Future+Electronics; ComponentLink5Description: https://datasheet.ciiva.com/16216/abm8g-16216655.pdf?src-supplier=Future+Electronics; Manufacturer Part Number: ABM8G-12.000MHZ-4Y-T3; Manufacturer: Abracon; Supplier Part Number 1: 535-10901-1-ND; Category: Crystals